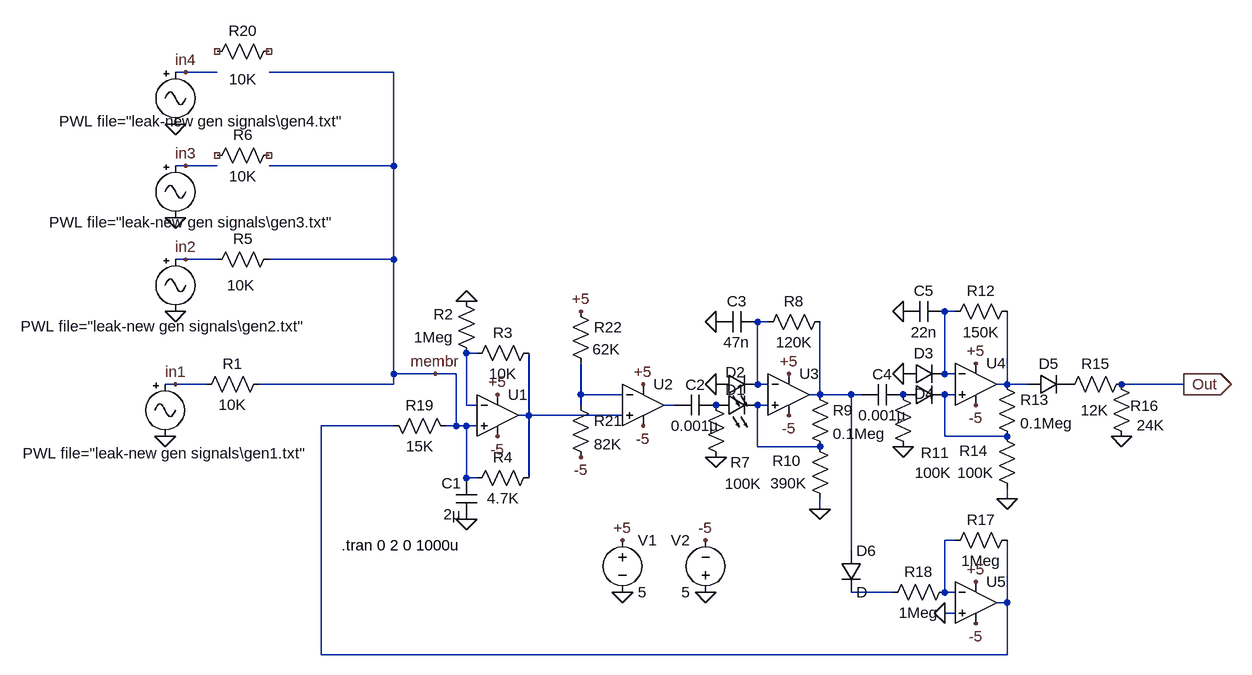
[diagram p0: schematic Leak-new.asc]
Leak-new.asc, the LTspice schematic file:
Version 4
SHEET 1 2784 1552
WIRE -656 -704 -672 -704
WIRE -608 -704 -656 -704
WIRE -336 -704 -528 -704
WIRE -656 -560 -672 -560
WIRE -608 -560 -656 -560
WIRE -336 -560 -336 -704
WIRE -336 -560 -528 -560
WIRE -656 -416 -672 -416
WIRE -608 -416 -656 -416
WIRE -336 -416 -336 -560
WIRE -336 -416 -528 -416
WIRE 528 -336 512 -336
WIRE 240 -320 224 -320
WIRE -208 -272 -224 -272
WIRE -336 -240 -336 -416
WIRE -272 -240 -336 -240
WIRE -240 -240 -272 -240
WIRE 512 -240 512 -336
WIRE 528 -240 512 -240
WIRE -672 -224 -688 -224
WIRE -624 -224 -672 -224
WIRE -336 -224 -336 -240
WIRE -336 -224 -544 -224
WIRE 224 -224 224 -320
WIRE 240 -224 224 -224
WIRE 608 -224 608 -336
WIRE 608 -224 592 -224
WIRE 640 -224 608 -224
WIRE 880 -224 784 -224
WIRE -48 -208 -48 -256
WIRE 16 -208 -48 -208
WIRE 320 -208 320 -320
WIRE 320 -208 304 -208
WIRE 368 -208 320 -208
WIRE 384 -208 368 -208
WIRE 528 -208 512 -208
WIRE -224 -192 -224 -272
WIRE -208 -192 -224 -192
WIRE -48 -192 -48 -208
WIRE 96 -192 80 -192
WIRE 240 -192 224 -192
WIRE -128 -176 -128 -272
WIRE -128 -176 -144 -176
WIRE 16 -176 -128 -176
WIRE -336 -160 -448 -160
WIRE -240 -160 -240 -240
WIRE -240 -160 -256 -160
WIRE -224 -160 -240 -160
WIRE -208 -160 -224 -160
WIRE 512 -144 512 -208
WIRE 608 -144 512 -144
WIRE 224 -128 224 -192
WIRE 320 -128 224 -128
WIRE -224 -80 -224 -160
WIRE -208 -80 -224 -80
WIRE -128 -80 -128 -176
WIRE 608 -48 608 -64
WIRE 320 -32 320 -48
WIRE 528 16 512 16
WIRE 368 32 368 -208
WIRE 432 96 368 96
WIRE 512 96 512 16
WIRE 528 96 512 96
WIRE 608 112 608 16
WIRE 608 112 592 112
WIRE 528 128 512 128
WIRE -448 192 -448 -160
WIRE 608 192 608 112
WIRE 608 192 -448 192
FLAG -688 -144 0
FLAG 272 -240 +5
FLAG 272 -176 -5
FLAG 160 -224 0
FLAG 160 -320 0
FLAG 160 -112 0
FLAG 320 -32 0
FLAG -176 -208 +5
FLAG -176 -144 -5
FLAG -224 -16 0
FLAG -224 -352 0
FLAG 16 96 0
FLAG 144 96 0
FLAG 144 16 -5
FLAG 16 16 +5
FLAG 48 -224 +5
FLAG 48 -160 -5
FLAG 560 -256 +5
FLAG 560 -192 -5
FLAG 448 -240 0
FLAG 448 -336 0
FLAG 448 -128 0
FLAG 608 -48 0
FLAG 784 -144 0
FLAG 880 -224 Out
IOPIN 880 -224 Out
FLAG 560 80 +5
FLAG 560 144 -5
FLAG 512 128 0
FLAG -672 -336 0
FLAG -672 -480 0
FLAG -272 -240 membr
FLAG -672 -224 in1
FLAG -656 -416 in2
FLAG -656 -560 in3
FLAG -672 -624 0
FLAG -656 -704 in4
FLAG -48 -112 -5
FLAG -48 -336 +5
SYMBOL res -528 -240 R90
WINDOW 0 0 56 VBottom 2
WINDOW 3 32 56 VTop 2
SYMATTR InstName R1
SYMATTR Value 10K
SYMBOL Opamps\\UniversalOpamp2 272 -208 R0
SYMATTR InstName U3
SYMBOL LED 160 -208 R270
WINDOW 0 19 30 VTop 2
WINDOW 3 0 32 Invisible 2
SYMATTR InstName D2
SYMATTR Value QTLP690C
SYMATTR Description Diode
SYMATTR Type diode
SYMBOL res 304 -224 R0
SYMATTR InstName R9
SYMATTR Value 0.1Meg
SYMBOL res 336 -32 R180
WINDOW 0 45 74 Left 2
WINDOW 3 36 40 Left 2
SYMATTR InstName R10
SYMATTR Value 390K
SYMBOL res 144 -208 R0
WINDOW 0 38 104 Left 2
WINDOW 3 30 137 Left 2
SYMATTR InstName R7
SYMATTR Value 100K
SYMBOL res 336 -336 R90
WINDOW 0 0 56 VBottom 2
WINDOW 3 32 56 VTop 2
SYMATTR InstName R8
SYMATTR Value 120K
SYMBOL cap 224 -336 R90
WINDOW 0 0 32 VBottom 2
WINDOW 3 32 32 VTop 2
SYMATTR InstName C3
SYMATTR Value 47n
SYMBOL cap 160 -208 R90
WINDOW 0 0 32 VBottom 2
WINDOW 3 32 32 VTop 2
SYMATTR InstName C2
SYMATTR Value 0.001µ
SYMBOL Opamps\\UniversalOpamp2 -176 -176 R0
SYMATTR InstName U1
SYMBOL cap -208 -16 R180
WINDOW 0 24 56 Left 2
WINDOW 3 24 8 Left 2
SYMATTR InstName C1
SYMATTR Value 2µ
SYMBOL res -112 -288 R90
WINDOW 0 0 56 VBottom 2
WINDOW 3 32 56 VTop 2
SYMATTR InstName R3
SYMATTR Value 10K
SYMBOL res -112 -96 R90
WINDOW 0 0 56 VBottom 2
WINDOW 3 32 56 VTop 2
SYMATTR InstName R4
SYMATTR Value 4.7K
SYMBOL res -208 -256 R180
WINDOW 0 36 76 Left 2
WINDOW 3 36 40 Left 2
SYMATTR InstName R2
SYMATTR Value 1Meg
SYMBOL voltage 16 0 R0
WINDOW 123 0 0 Left 2
WINDOW 39 0 0 Left 2
SYMATTR InstName V1
SYMATTR Value 5
SYMBOL voltage 144 112 R180
WINDOW 0 24 96 Left 2
WINDOW 3 24 16 Left 2
WINDOW 123 0 0 Left 2
WINDOW 39 0 0 Left 2
SYMATTR InstName V2
SYMATTR Value 5
SYMBOL Misc\\signal -688 -240 R0
WINDOW 0 24 16 Invisible 2
WINDOW 3 -219 122 Left 2
WINDOW 123 0 0 Left 2
WINDOW 39 0 0 Left 2
SYMATTR InstName V3
SYMATTR Value PWL file="leak-new gen signals\gen1.txt"
SYMBOL Opamps\\UniversalOpamp2 48 -192 R0
SYMATTR InstName U2
SYMBOL Opamps\\UniversalOpamp2 560 -224 R0
SYMATTR InstName U4
SYMBOL diode 448 -224 R270
WINDOW 0 32 32 VTop 2
WINDOW 3 0 32 Invisible 2
SYMATTR InstName D3
SYMBOL diode 448 -192 R270
WINDOW 0 2 33 VTop 2
WINDOW 3 0 32 Invisible 2
SYMATTR InstName D4
SYMBOL res 592 -240 R0
SYMATTR InstName R13
SYMATTR Value 0.1Meg
SYMBOL res 624 -48 R180
WINDOW 0 45 74 Left 2
WINDOW 3 36 40 Left 2
SYMATTR InstName R14
SYMATTR Value 100K
SYMBOL res 432 -224 R0
WINDOW 0 43 105 Left 2
WINDOW 3 34 136 Left 2
SYMATTR InstName R11
SYMATTR Value 100K
SYMBOL res 624 -352 R90
WINDOW 0 0 56 VBottom 2
WINDOW 3 32 56 VTop 2
SYMATTR InstName R12
SYMATTR Value 150K
SYMBOL cap 512 -352 R90
WINDOW 0 0 32 VBottom 2
WINDOW 3 32 32 VTop 2
SYMATTR InstName C5
SYMATTR Value 22n
SYMBOL cap 448 -224 R90
WINDOW 0 0 32 VBottom 2
WINDOW 3 32 32 VTop 2
SYMATTR InstName C4
SYMATTR Value 0.001µ
SYMBOL diode 640 -208 R270
WINDOW 0 32 32 VTop 2
WINDOW 3 0 32 Invisible 2
SYMATTR InstName D5
SYMBOL res 800 -240 R90
WINDOW 0 0 56 VBottom 2
WINDOW 3 40 57 VTop 2
SYMATTR InstName R15
SYMATTR Value 12K
SYMBOL res 800 -128 R180
WINDOW 0 -42 63 Left 2
WINDOW 3 -50 33 Left 2
SYMATTR InstName R16
SYMATTR Value 24K
SYMBOL Opamps\\UniversalOpamp2 560 112 R0
SYMATTR InstName U5
SYMBOL res 624 0 R90
WINDOW 0 0 56 VBottom 2
WINDOW 3 32 56 VTop 2
SYMATTR InstName R17
SYMATTR Value 1Meg
SYMBOL res 416 112 R270
WINDOW 0 32 56 VTop 2
WINDOW 3 0 56 VBottom 2
SYMATTR InstName R18
SYMATTR Value 1Meg
SYMBOL diode 352 32 R0
SYMATTR InstName D6
SYMBOL res -352 -176 M90
WINDOW 0 0 56 VBottom 2
WINDOW 3 32 56 VTop 2
SYMATTR InstName R19
SYMATTR Value 15K
SYMBOL res -512 -432 R90
WINDOW 0 0 56 VBottom 2
WINDOW 3 40 59 VTop 2
SYMATTR InstName R5
SYMATTR Value 10K
SYMBOL Misc\\signal -672 -432 R0
WINDOW 0 24 16 Invisible 2
WINDOW 3 -238 119 Left 2
WINDOW 123 0 0 Left 2
WINDOW 39 0 0 Left 2
SYMATTR InstName V5
SYMATTR Value PWL file="leak-new gen signals\gen2.txt"
SYMBOL res -512 -592 R90
WINDOW 0 0 56 VBottom 2
WINDOW 3 32 56 VTop 2
SYMATTR InstName R6
SYMATTR Value 10K
SYMBOL Misc\\signal -672 -576 R0
WINDOW 0 24 16 Invisible 2
WINDOW 3 -194 103 Left 2
WINDOW 123 0 0 Left 2
WINDOW 39 0 0 Left 2
SYMATTR InstName V6
SYMATTR Value PWL file="leak-new gen signals\gen3.txt"
SYMBOL res -512 -752 R90
WINDOW 0 0 56 VBottom 2
WINDOW 3 43 56 VTop 2
SYMATTR InstName R20
SYMATTR Value 10K
SYMBOL Misc\\signal -672 -720 R0
WINDOW 0 24 16 Invisible 2
WINDOW 3 -179 91 Left 2
WINDOW 123 0 0 Left 2
WINDOW 39 0 0 Left 2
SYMATTR InstName V7
SYMATTR Value PWL file="leak-new gen signals\gen4.txt"
SYMBOL res -64 -208 R0
SYMATTR InstName R21
SYMATTR Value 82K
SYMBOL res -64 -352 R0
WINDOW 3 34 74 Left 2
SYMATTR Value 62K
SYMATTR InstName R22
SYMBOL LED 160 -176 R270
WINDOW 0 24 30 VTop 2
WINDOW 3 0 32 Invisible 2
SYMATTR InstName D1
SYMATTR Value AOT-2015
SYMATTR Description Diode
SYMATTR Type diode
TEXT -416 24 Left 2 !.tran 0 2 0 1000u

The netlist it stands for:
* Leak-new.asc
R1 membr in1 10K
XU3 N009 N002 +5 -5 N006 level.2 Avol=1Meg GBW=10Meg Slew=10Meg ilimit=25m rail=0 Vos=0 phimargin=45 en=0 enk=0 in=0 ink=0 Rin=500Meg  ; pins IN+ IN- V+ V- OUT
D2 0 N002 QTLP690C
R9 N006 N009 0.1Meg
R10 0 N009 390K
R7 P001 0 100K
R8 N006 N002 120K
C3 N002 0 47n
C2 P001 N008 0.001µ
XU1 membr N003 +5 -5 N010 level.2 Avol=1Meg GBW=10Meg Slew=10Meg ilimit=25m rail=0 Vos=0 phimargin=45 en=0 enk=0 in=0 ink=0 Rin=500Meg  ; pins IN+ IN- V+ V- OUT
C1 0 membr 2µ
R3 N010 N003 10K
R4 N010 membr 4.7K
R2 N003 0 1Meg
V1 +5 0 5
V2 0 -5 5
V3 in1 0 PWL file="leak-new gen signals\gen1.txt"
XU2 N010 N005 +5 -5 N008 level.2 Avol=1Meg GBW=10Meg Slew=10Meg ilimit=25m rail=0 Vos=0 phimargin=45 en=0 enk=0 in=0 ink=0 Rin=500Meg  ; pins IN+ IN- V+ V- OUT
XU4 N007 N001 +5 -5 N004 level.2 Avol=1Meg GBW=10Meg Slew=10Meg ilimit=25m rail=0 Vos=0 phimargin=45 en=0 enk=0 in=0 ink=0 Rin=500Meg  ; pins IN+ IN- V+ V- OUT
D3 0 N001 D
D4 P002 N007 D
R13 N004 N007 0.1Meg
R14 0 N007 100K
R11 P002 0 100K
R12 N004 N001 150K
C5 N001 0 22n
C4 P002 N006 0.001µ
D5 N004 P003 D
R15 Out P003 12K
R16 0 Out 24K
XU5 0 N012 +5 -5 N011 level.2 Avol=1Meg GBW=10Meg Slew=10Meg ilimit=25m rail=0 Vos=0 phimargin=45 en=0 enk=0 in=0 ink=0 Rin=500Meg  ; pins IN+ IN- V+ V- OUT
R17 N011 N012 1Meg
R18 N013 N012 1Meg
D6 N006 N013 D
R19 N011 membr 15K
R5 membr in2 10K
V5 in2 0 PWL file="leak-new gen signals\gen2.txt"
R6 NC_01 NC_02 10K
V6 in3 0 PWL file="leak-new gen signals\gen3.txt"
R20 NC_03 NC_04 10K
V7 in4 0 PWL file="leak-new gen signals\gen4.txt"
R21 N005 -5 82K
R22 +5 N005 62K
D1 P001 N009 AOT-2015
.model D D
.lib standard.dio
.tran 0 2 0 1000u
.lib UniversalOpamps2.sub
.backanno
.end